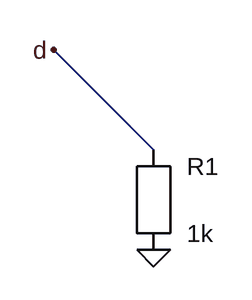
[diagram p0: schematic diagonal_wire_end.asc]
diagonal_wire_end.asc, the LTspice schematic file:
Version 4
SHEET 1 880 680
WIRE 0 0 96 96
SYMBOL res 96 144 R0
SYMATTR InstName R1
SYMATTR Value 1k
FLAG 96 192 0
FLAG 0 0 d

The netlist it stands for:
* diagonal_wire_end.asc
R1 d 0 1k
.backanno
.end